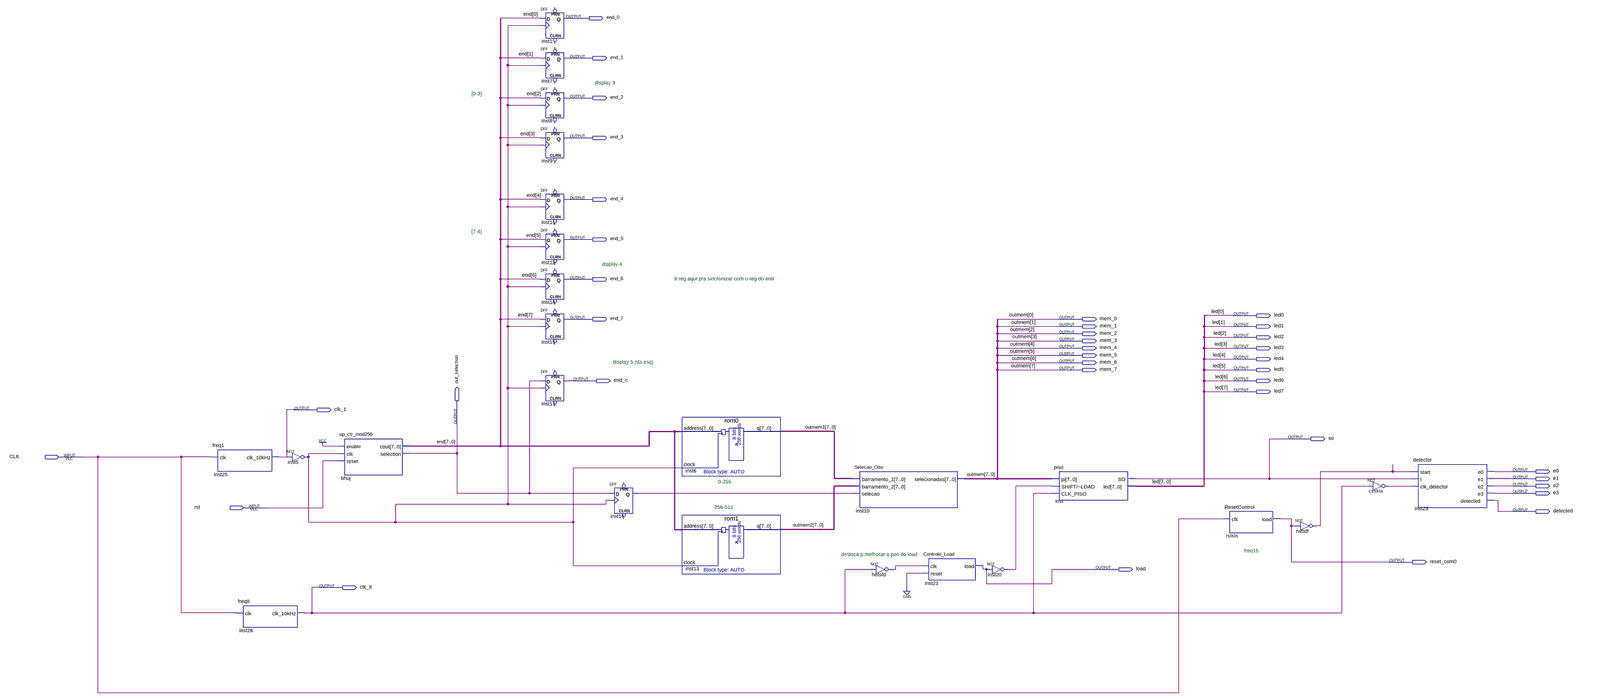
[diagram p0: schematic sheet, whole]
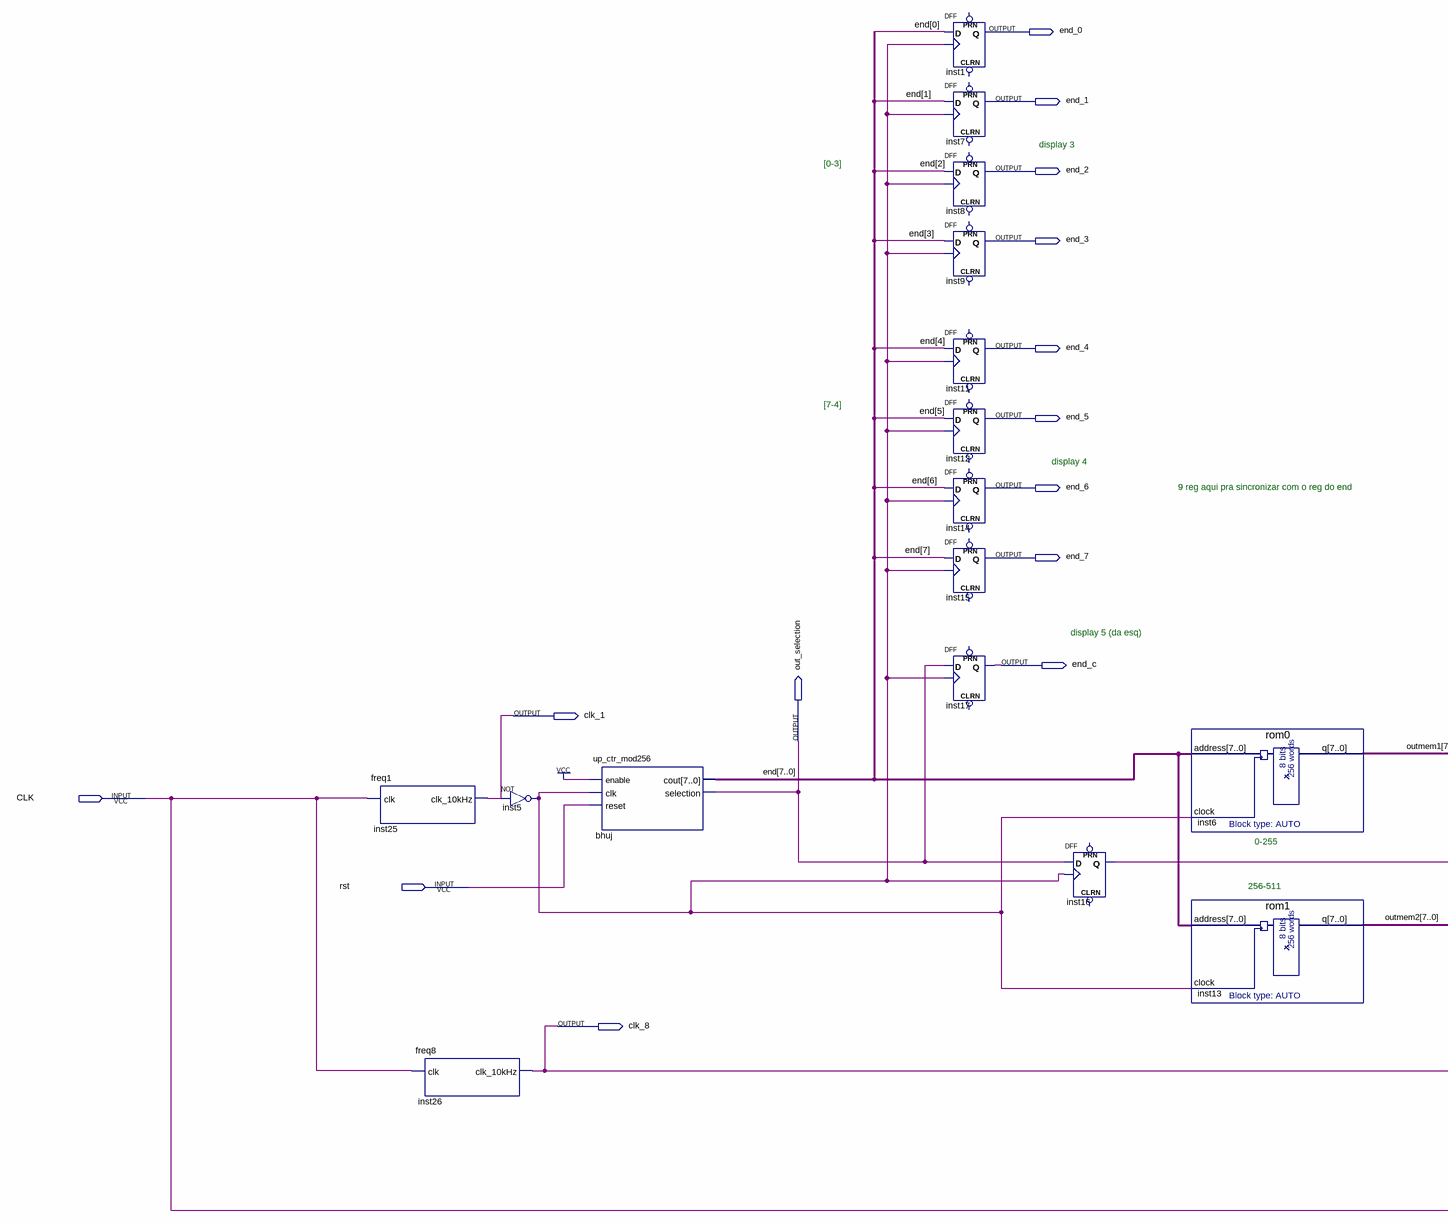
[diagram p1: schematic sheet, left part]
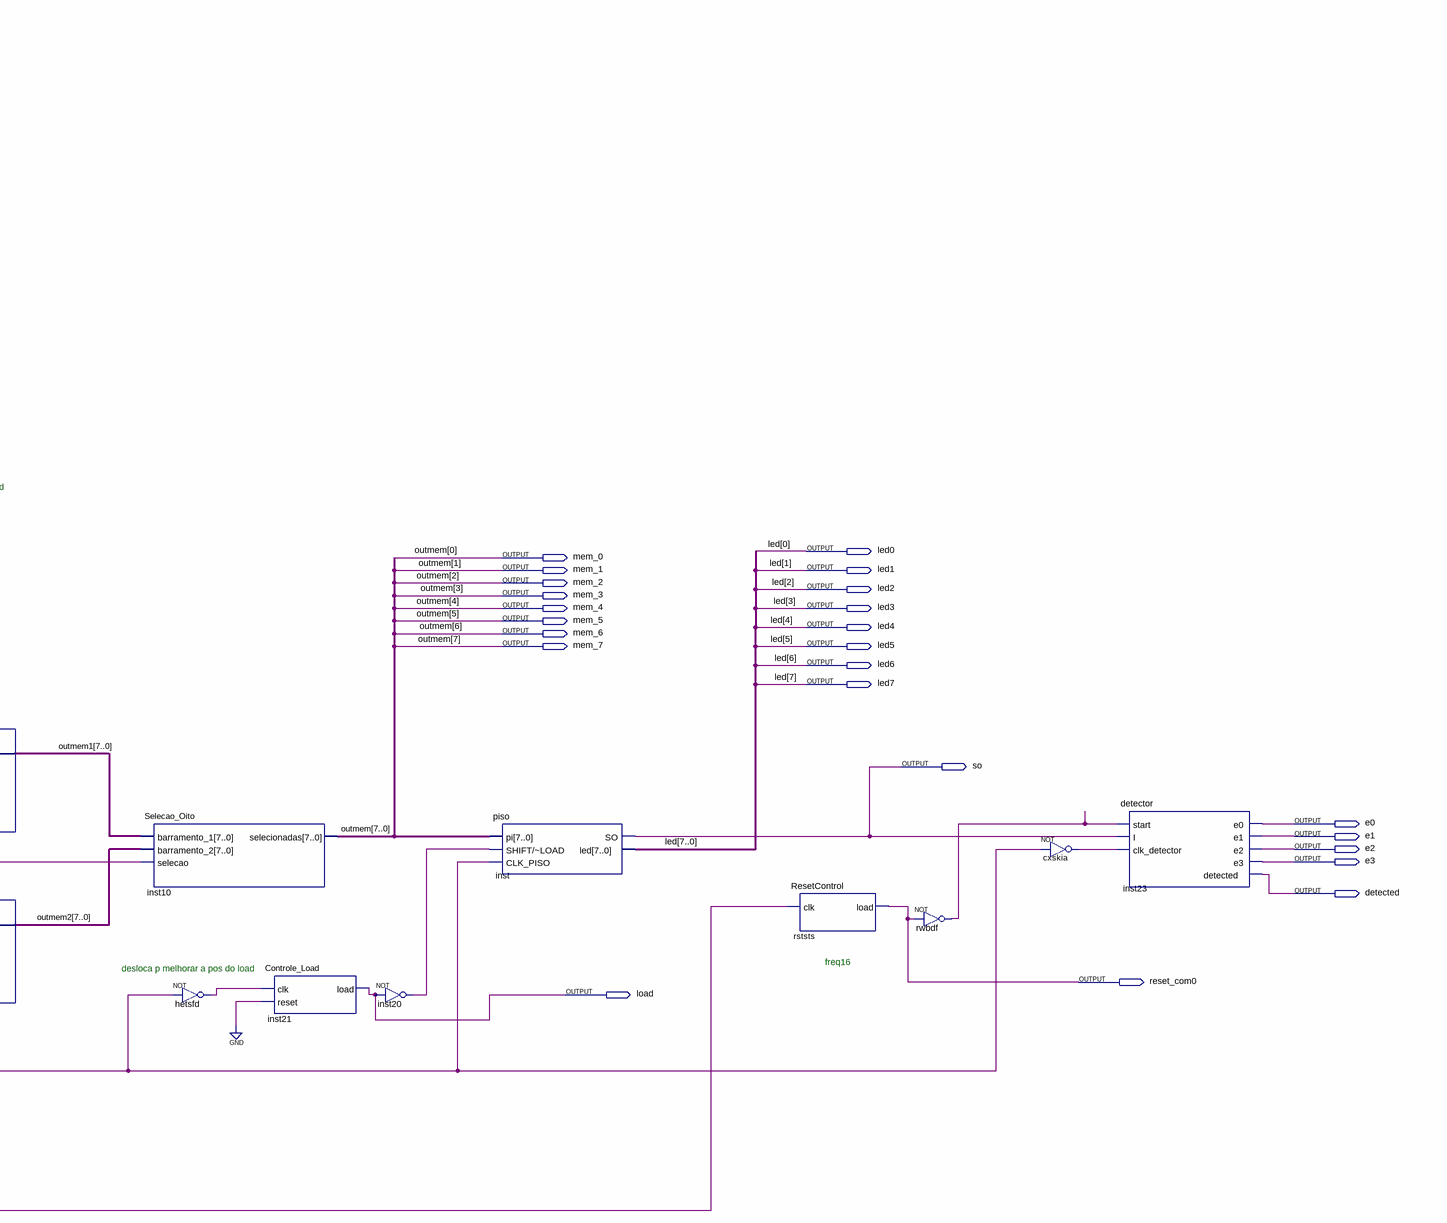
[diagram p2: schematic sheet, right part]
// Quartus schematic teste_cont.bdf as structural Verilog: 25 symbols, 38 pins
module teste_cont (
  input  CLK,
  input  rst,
  output end_0,
  output end_1,
  output end_2,
  output end_3,
  output end_4,
  output end_5,
  output end_6,
  output led0,
  output end_7,
  output mem_0,
  output mem_1,
  output led1,
  output mem_2,
  output led2,
  output mem_3,
  output mem_4,
  output led3,
  output mem_5,
  output led4,
  output mem_6,
  output mem_7,
  output led5,
  output end_c,
  output led6,
  output led7,
  output clk_1,
  output out_selection,
  output so,
  output e0,
  output e1,
  output e2,
  output e3,
  output detected,
  output reset_com0,
  output load,
  output clk_8
);

  wire cxskia_out, hetsfd_out, inst5_out, inst16_q, inst20_out, rwbdf_out;
  wire [7:0] \end , outmem1, outmem2;

  freq1 inst25 (.clk(CLK), .clk_10kHz(clk_1));
  freq8 inst26 (.clk(CLK), .clk_10kHz(clk_8));
  not inst5 (inst5_out, clk_1);
  up_ctr_mod256 bhuj (.enable(1'b1), .clk(inst5_out), .reset(rst), .cout(\end ), .selection(out_selection));
  DFF inst1 (.CLK(inst5_out), .D(\end [0]), .Q(end_0));  // open: CLRN, PRN
  DFF inst7 (.CLK(inst5_out), .D(\end [1]), .Q(end_1));  // open: CLRN, PRN
  DFF inst8 (.CLK(inst5_out), .D(\end [2]), .Q(end_2));  // open: CLRN, PRN
  DFF inst9 (.CLK(inst5_out), .D(\end [3]), .Q(end_3));  // open: CLRN, PRN
  DFF inst11 (.CLK(inst5_out), .D(\end [4]), .Q(end_4));  // open: CLRN, PRN
  DFF inst12 (.CLK(inst5_out), .D(\end [5]), .Q(end_5));  // open: CLRN, PRN
  DFF inst14 (.CLK(inst5_out), .D(\end [6]), .Q(end_6));  // open: CLRN, PRN
  DFF inst15 (.CLK(inst5_out), .D(\end [7]), .Q(end_7));  // open: CLRN, PRN
  DFF inst17 (.CLK(inst5_out), .D(out_selection), .Q(end_c));  // open: CLRN, PRN
  DFF inst16 (.CLK(inst5_out), .D(out_selection), .Q(inst16_q));  // open: CLRN, PRN
  rom0 inst6 (.address(\end ), .clock(inst5_out), .q(outmem1));
  rom1 inst13 (.address(\end ), .clock(inst5_out), .q(outmem2));
  Selecao_Oito inst10 (
    .barramento_1(outmem1), .barramento_2(outmem2), .selecao(inst16_q),
    .selecionadas({mem_7, mem_6, mem_5, mem_4, mem_3, mem_2, mem_1, mem_0}));
  not hetsfd (hetsfd_out, clk_8);
  Controle_Load inst21 (.clk(hetsfd_out), .reset(1'b0), .load(load));
  not inst20 (inst20_out, load);
  piso inst (
    .pi({mem_7, mem_6, mem_5, mem_4, mem_3, mem_2, mem_1, mem_0}), .\SHIFT/~LOAD (inst20_out),
    .CLK_PISO(clk_8), .SO(so), .led({led7, led6, led5, led4, led3, led2, led1, led0}));
  ResetControl rststs (.clk(CLK), .load(reset_com0));
  not rwbdf (rwbdf_out, reset_com0);
  not cxskia (cxskia_out, clk_8);
  detector inst23 (
    .start(rwbdf_out), .I(so), .clk_detector(cxskia_out), .e0(e0), .e1(e1), .e2(e2), .e3(e3),
    .detected(detected));

  // Other names for the same wires on the sheet: outmem[7:0] = {mem_7, mem_6, mem_5, mem_4, mem_3, mem_2, mem_1, mem_0}

  // Notes on the sheet:
  //   display 3
  //   [0-3]
  //   [7-4]
  //   display 4
  //   9 reg aqui pra sincronizar com o reg do end
  //   display 5 (da esq)
  //   0-255
  //   256-511
  //   freq16
  //   desloca p melhorar a pos do load
endmodule
